# EAGLE design Robot Kicker v3.6 (EAGLE 4.16)
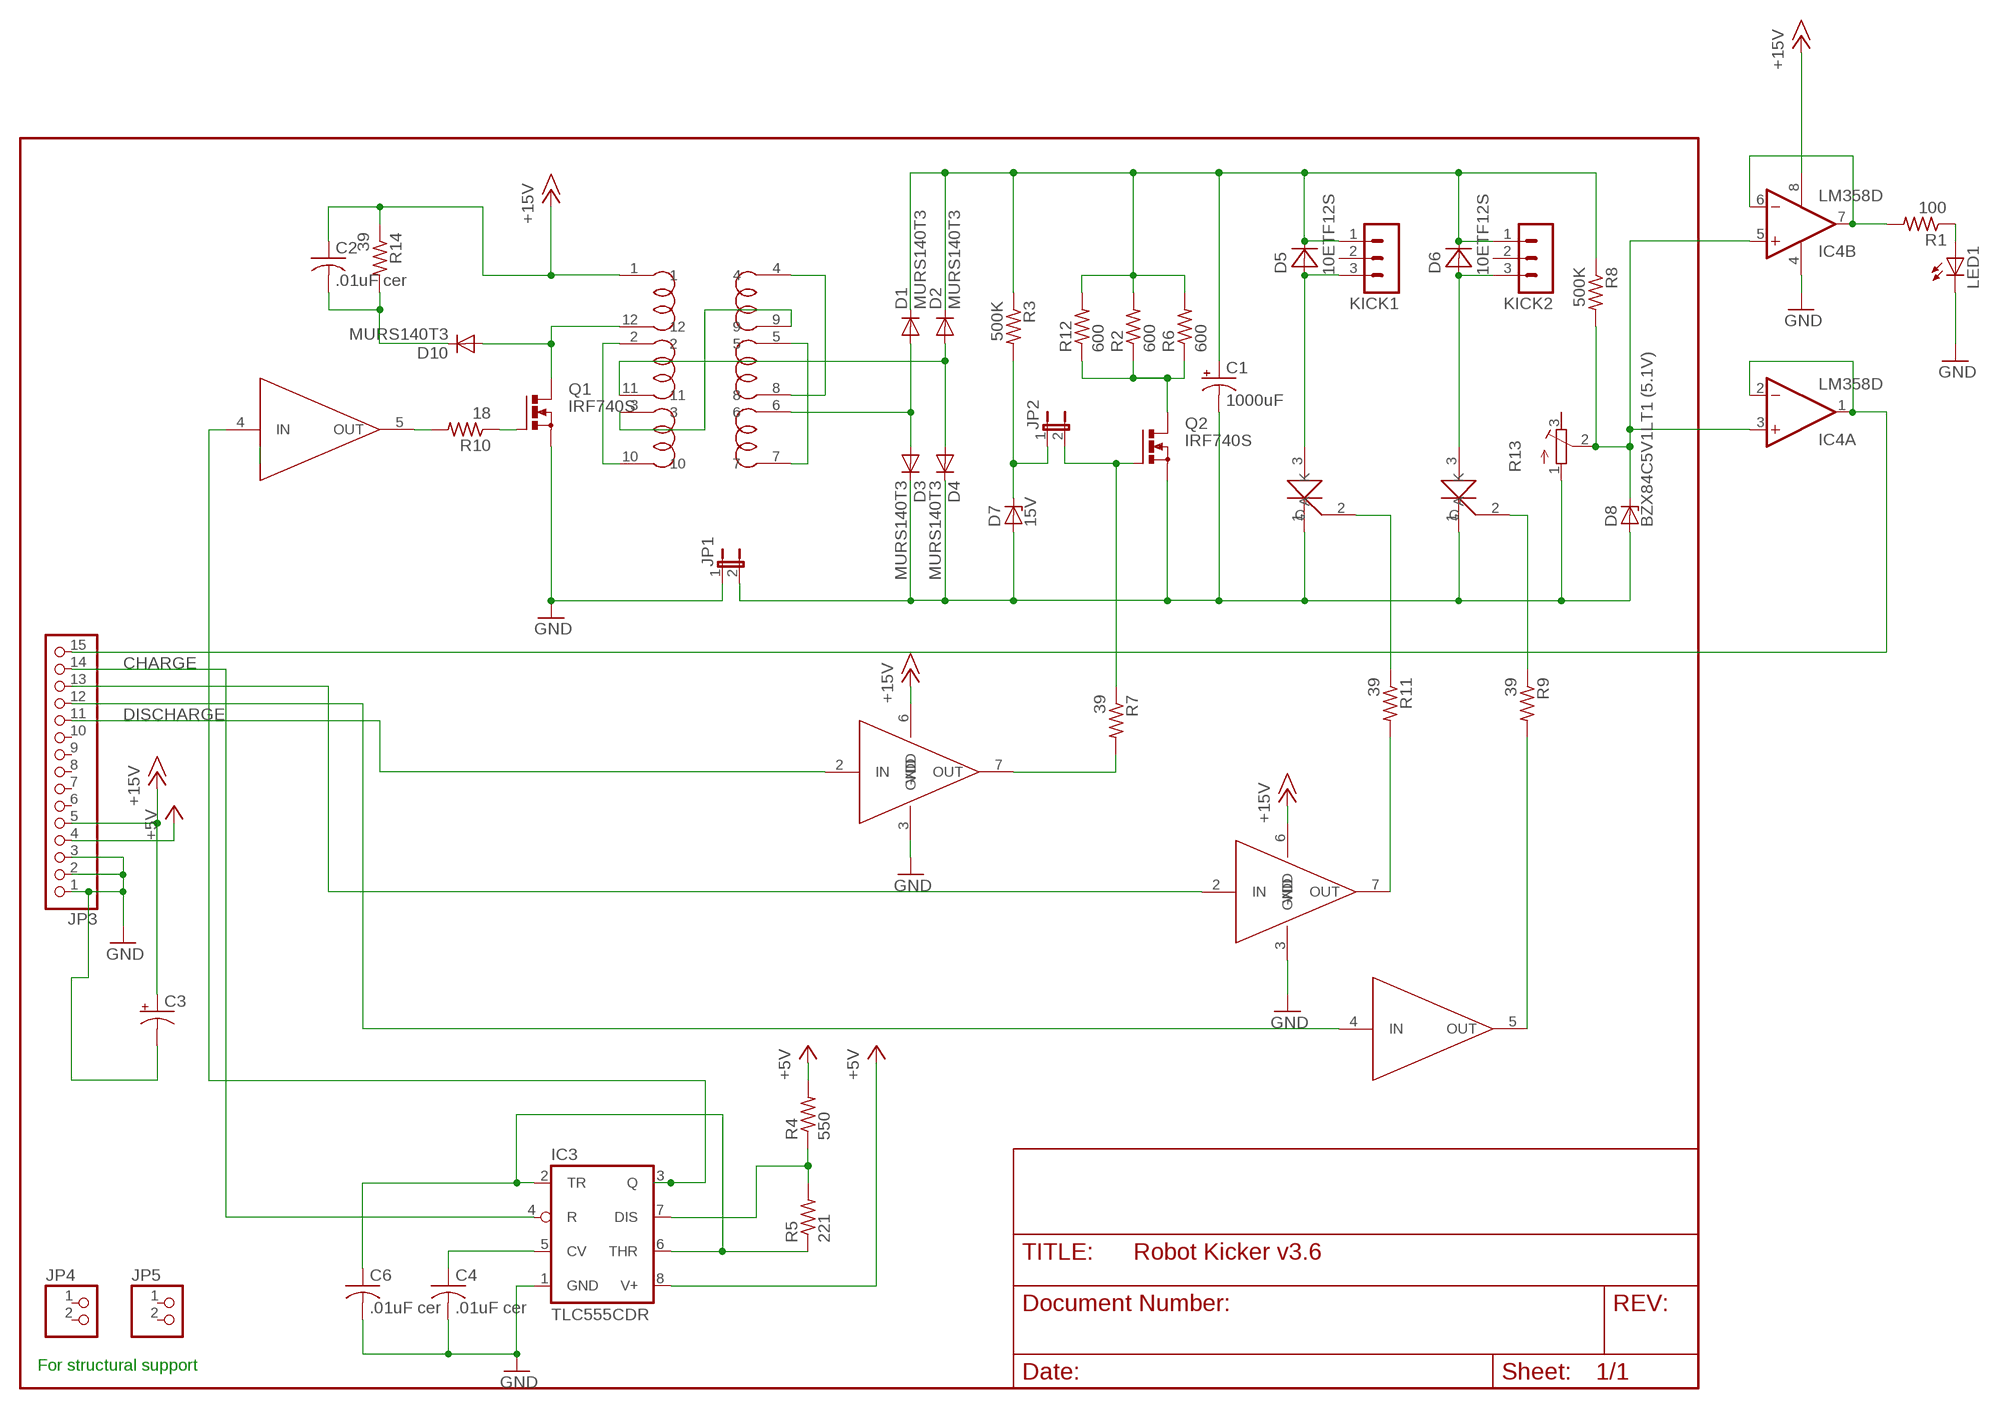
[diagram p0: schematic, sheet 1]

## Parts
C1  1000uF  CPOL-USE10-35  [EB35D]
C2  .01uF cer  C-USC1206  [C1206]
C3  CPOL-USE5-8.5  [E5-8,5]
C4  .01uF cer  C-USC1206  [C1206]
C6  .01uF cer  C-USC1206  [C1206]
D1  MURS140T3  ES2D  [SMB]
D2  MURS140T3  ES2D  [SMB]
D3  MURS140T3  ES2D  [SMB]
D4  MURS140T3  ES2D  [SMB]
D5  10ETF12S  [D2PACK]
D6  10ETF12S  [D2PACK]
D7  15V  ZENER-DIODESOT23  [SOT23]
D8  BZX84C5V1LT1 (5.1V)  ZENER-DIODESOT23  [SOT23]
D10  MURS140T3  ES2D  [SMB]
IC1  TC4424  [DIL08]
IC2  TC4424  [DIL08]
IC3  TLC555CDR  LM555D  [SO08]
IC4  LM358D  [SO08]
JP1  JP1E  [JP1]
JP2  JP1E  [JP1]
JP3  PINHD-1X15  [1X15]
JP4  PINHD-1X2  [1X02]
JP5  PINHD-1X2  [1X02]
KICK1  MA03-1  [MA03-1]
KICK2  MA03-1  [MA03-1]
LED1  LEDCHIPLED_1206  [CHIPLED_1206]
Q1  IRF740S  [D2PACK]
Q2  IRF740S  [D2PACK]
R1  100  R-US_R1206  [R1206]
R2  600  R-US_R2512  [R2512]
R3  500K  R-US_R1206  [R1206]
R4  550  R-US_R1206  [R1206]
R5  221  R-US_R1206  [R1206]
R6  600  R-US_R2512  [R2512]
R7  39  R-US_R1206  [R1206]
R8  500K  R-US_R1206  [R1206]
R9  39  R-US_R1206  [R1206]
R10  18  R-US_R1206  [R1206]
R11  39  R-US_R1206  [R1206]
R12  600  R-US_R2512  [R2512]
R13  R-TRIMM4G/J  [RTRIM4G/J]
R14  39  R-US_R1206  [R1206]
SCR3  SCR  [SCR]
SCR4  SCR  [SCR]
U$1  PCA20EFD  [PCA20EFD]

## Nets
+5V: IC3.8(V+) JP3.4 R4.2
+15V: C2.1 C3.+ IC1.6(VDD) IC2.6(VDD) IC4.8(P:V+) JP3.5 R14.1 U$1.1
ADC: IC4.1(A:OUT) IC4.2(A:-IN) JP3.15
CHARGE: IC3.4(R) JP3.14
DISCHARGE: IC1.2(IN) JP3.11
GND: C3.- C4.2 C6.2 IC1.3(GND) IC2.3(GND) IC3.1(GND) IC4.4(P:V-) JP1.1 JP3.1 JP3.2 JP3.3 LED1.C Q1.3(S)
HV+: C1.+ D1.C D2.C D5.2(C) D6.2(C) KICK1.1 KICK2.1 R2.2 R3.1 R6.2 R8.1 R12.2
HV-: C1.- D3.C D4.C D7.1(A) D8.1(A) JP1.2 Q2.3(S) R13.1(E) SCR3.1(K) SCR4.1(K)
KICK1: IC2.2(IN) JP3.13
KICK2: IC2.4(IN) JP3.12
N$1: U$1.3 U$1.9
N$2: IC1.4(IN) IC3.3(Q)
N$3: D10.A Q1.2(D) U$1.12
N$4: U$1.2 U$1.10
N$5: IC1.5(OUT) R10.2
N$6: JP2.2 Q2.1(G) R7.1
N$7: IC4.6(B:-IN) IC4.7(B:OUT) R1.2
N$8: U$1.5 U$1.7
N$9: U$1.4 U$1.8
N$10: D1.A D3.A U$1.6
N$11: D2.A D4.A U$1.11
N$12: Q2.2(D) R2.1 R6.1 R12.1
N$13: LED1.A R1.1
N$14: C6.1 IC3.2(TR) IC3.6(THR) R5.1
N$15: Q1.1(G) R10.1
N$16: C4.1 IC3.5(CV)
N$17: IC3.7(DIS) R4.1 R5.2
N$18: R11.1 SCR3.2(G)
N$19: IC1.7(OUT) R7.2
N$20: R9.1 SCR4.2(G)
N$21: D5.1(A) KICK1.3 SCR3.3(A)
N$23: IC2.7(OUT) R11.2
N$24: D6.1(A) KICK2.3 SCR4.3(A)
N$25: C2.2 D10.C R14.2
N$26: IC2.5(OUT) R9.2
N$30: D7.3(C) JP2.1 R3.2
V_DIV: D8.3(C) IC4.3(A:+IN) IC4.5(B:+IN) R8.2 R13.2(S)
Unconnected: JP3.6 JP3.7 JP3.8 JP3.9 JP3.10 JP4.1 JP4.2 JP5.1 JP5.2 KICK1.2 KICK2.2 R13.3(A)

## Notes on the sheet
- For structural support

## Library data of the parts
C1 C3 = rcl:CPOL-US: POLARIZED CAPACITOR, American symbol
C2 C4 C6 = rcl:C-US: CAPACITOR, American symbol
D1-D4 D10 = diode:ES2D: DIODE super fast rectifier, 2 A
D5 D6 = diode:10ETF12S
D7 D8 = diode:ZENER-DIODE: Z-Diode
IC1 IC2 = transistor-power:TC4424
IC3 = linear:*555: TIMER
IC4 = linear:LM358: OP AMP
JP1 JP2 = jumper:JP1E: JUMPER
JP3 = pinhead:PINHD-1X15: PIN HEADER
JP4 JP5 = pinhead:PINHD-1X2: PIN HEADER
KICK1 KICK2 = con-lstb:MA03-1: PIN HEADER
LED1 = led:LED: LED OSRAM: - CHIPLED LG R971, LG N971, LY N971, LG Q971, LY Q971, LO R971, LY R971 LH N974, LH R974 LS Q976, LO Q976, LY Q976 LO Q996 - Hyper CHIPLED LW Q18S LB Q993, LB Q99A, LB R99A - SideLED LS A670, LO A670, LY A670, LG A670, LP A670 LB A673, LV A673, LT A673, LW A673 LH A674 LY A675 LS A676, LA A676, LO A676, LY A676, LW A676 LS A679, LY A679, LG A679 - Hyper Micro SIDELED® LS Y876, LA Y876, LO Y876, LY Y876 LT Y87S - SmartLED LW L88C, LW L88S LB L89C, LB L89S, LG L890 LS L89K, LO L89K, LY L89K LS L896, LA L896, LO L896, LY L896 - TOPLED LS T670, LO T670, LY T670, LG T670, LP T670 LSG T670, LSP T670, LSY T670, LOP T670, LYG T670 LG T671, LOG T671, LSG T671 LB T673, LV T673, LT T673, LW T673 LH T674 LS T676, LA T676, LO T676, LY T676, LB T676, LH T676, LSB T676, LW T676 LB T67C, LV T67C, LT T67C, LS T67K, LO T67K, LY T67K, LW E67C LS E67B, LA E67B, LO E67B, LY E67B, LB E67C, LV E67C, LT E67C LW T67C LS T679, LY T679, LG T679 LS T770, LO T770, LY T770, LG T770, LP T770 LB T773, LV T773, LT T773, LW T773 LH T774 LS E675, LA E675, LY E675, LS T675 LS T776, LA T776, LO T776, LY T776, LB T776 LHGB T686 LT T68C, LB T68C - Hyper Mini TOPLED® LB M676 - Mini TOPLED Santana® LG M470 LS M47K, LO M47K, LY M47K Source: http://www.osram.convergy.de/
Q1 Q2 = transistor-power:IRF740S
R1-R12 R14 = rcl:R-US_: RESISTOR, American symbol
R13 = rcl:R-TRIMM: Trimm resistor
SCR3 SCR4 = SCR:SCR
U$1 = transformer:PCA20EFD

## Net classes
1 big: width 1.27 mm

## Board
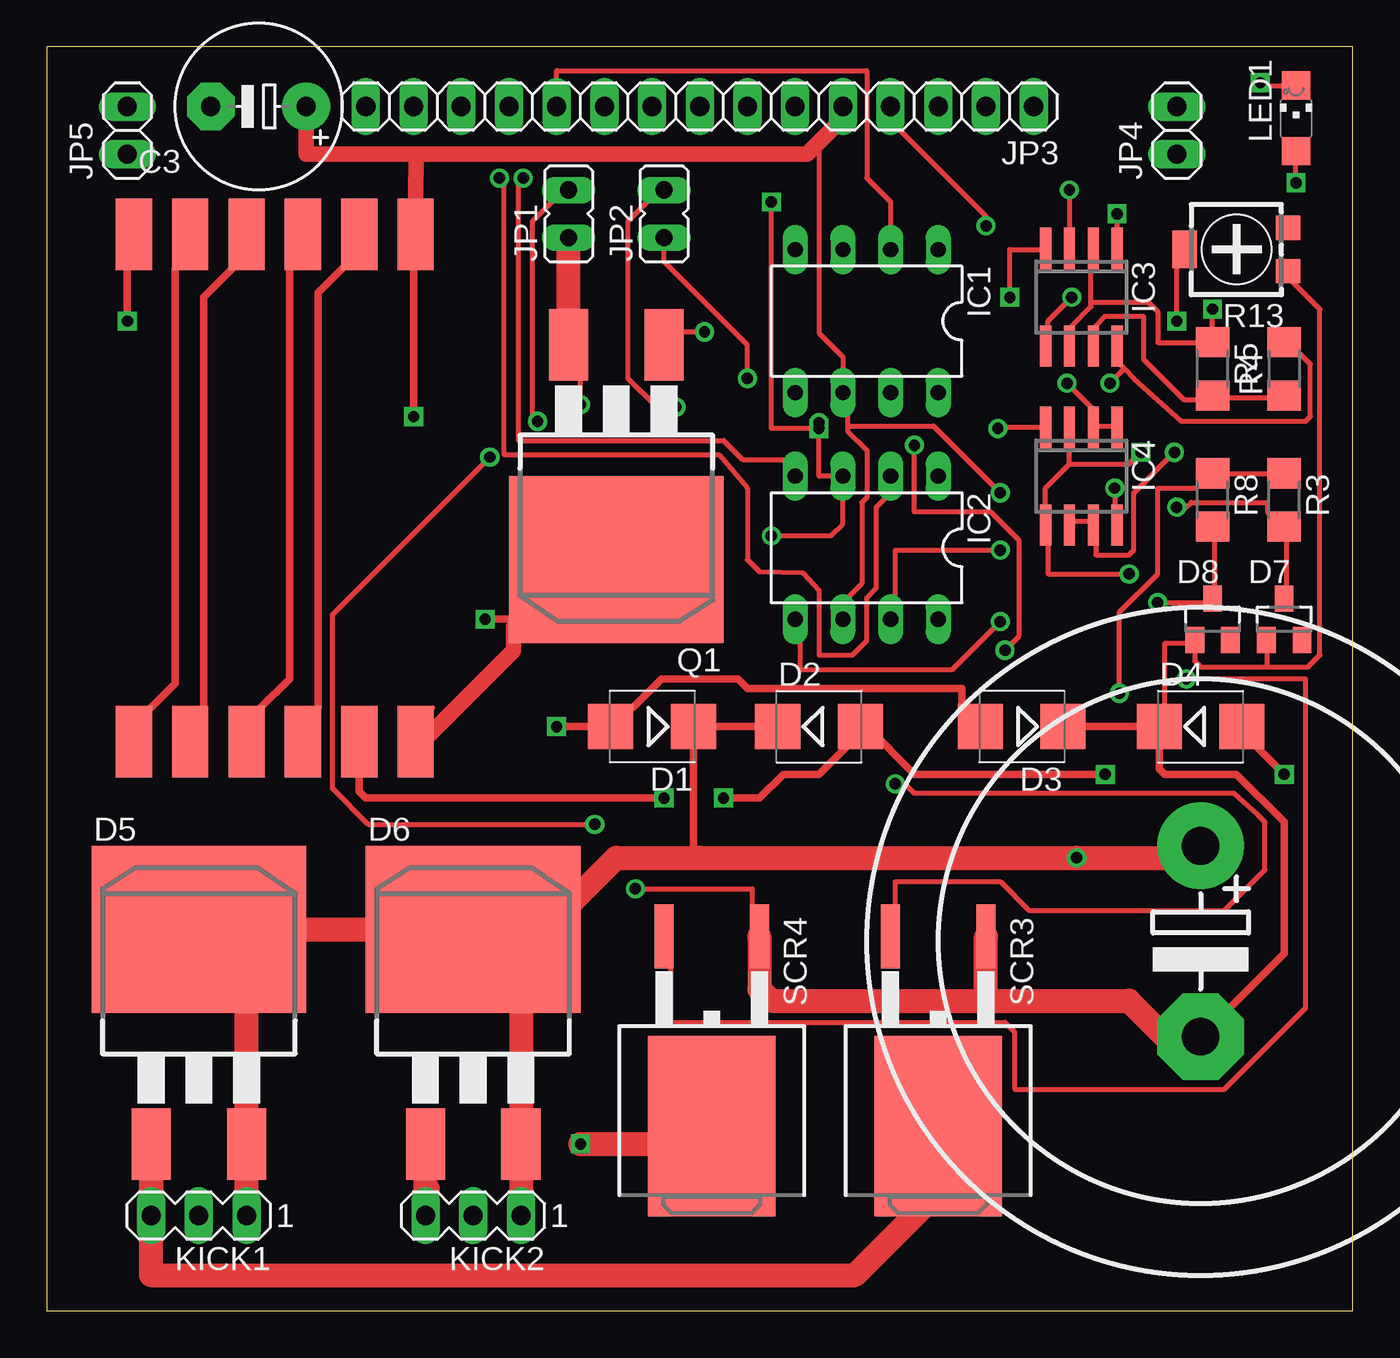
[diagram p1: board, top side]
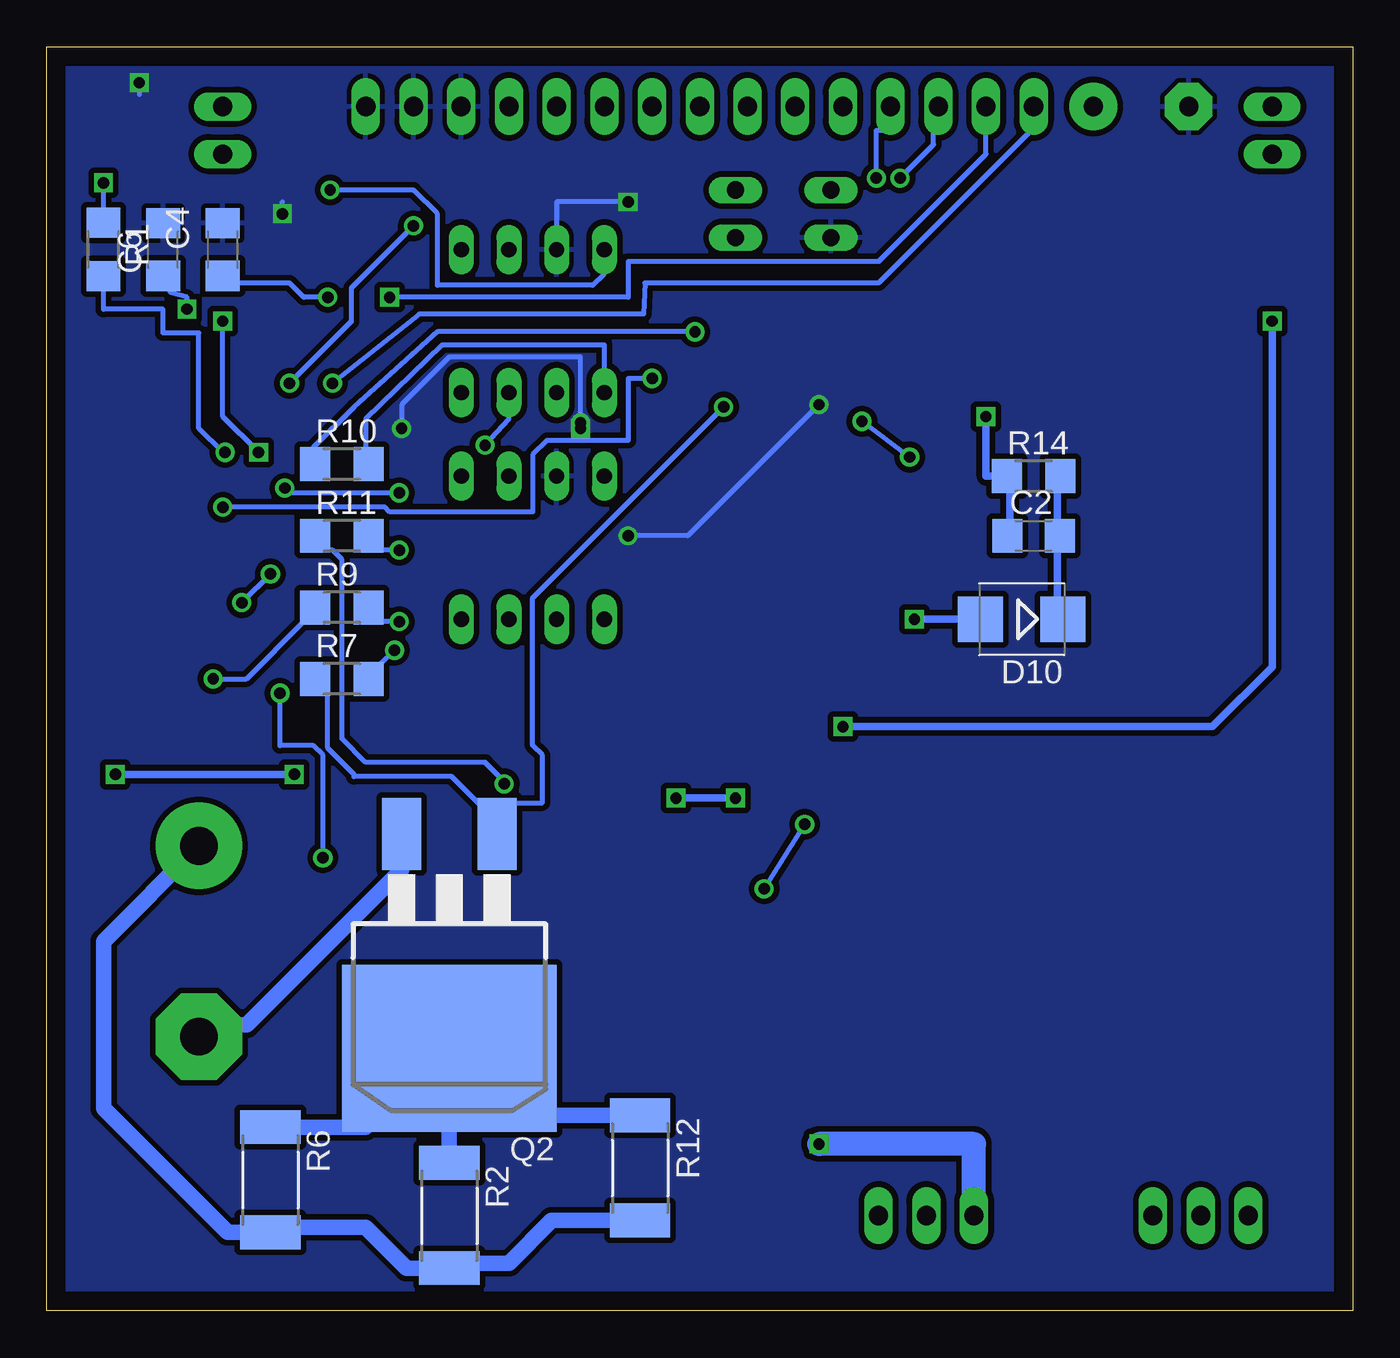
[diagram p2: board, bottom side, seen from below]

Size 69.52 x 67.3 mm. Coordinates in mm from the lower left corner, seen from the top.
Outline: 0,0 69.52,0 69.52,67.3 0,67.3 0,0
Copper layers (1*16): Top 0.035mm / dielectric 1.5mm / Bottom 0.035mm
Design rules "default": minimum track width 10mil, minimum drill 24mil, track to track 12mil, track to pad 12mil, pad to pad 8mil, via to via 8mil, smd to smd 8mil, copper to edge 40mil, drill to drill 8mil, minimum pad ring 10mil, minimum via ring 8mil, stop-mask expansion 4mil, vias tented up to drill 0mil, thermal gap 10mil

### Footprints (pad centres in the part's own frame; a part is rotated, then mirrored left to right if it is on the bottom)
EB35D = drill 2.007 pad 4.597 round: + -5.08,0 | drill 2.007 pad 4.597 octagon: - 5.08,0
C1206 = smd 1.6 x 1.8: 1 -1.4,0; 2 1.4,0
E5-8,5 = drill 1.016 pad 2.54 round: + -2.54,0 | drill 1.016 pad 2.54 octagon: - 2.54,0
SMB = smd 2.4 x 2.4: A 2.2,0; C -2.2,0
D2PACK = smd 2.083 x 3.81: 1 0,-10.16; 3 5.08,-10.16 | smd 11.43 x 8.89: 2 2.54,1.27
SOT23 = smd 1 x 1.4: 1 -0.95,-1.1; 2 0.95,-1.1; 3 0,1.1
DIL08 = drill 0.813 long: 1 -3.81,-3.81; 2 -1.27,-3.81; 3 1.27,-3.81; 4 3.81,-3.81; 5 3.81,3.81; 6 1.27,3.81; 7 -1.27,3.81; 8 -3.81,3.81
SO08 = smd 0.6 x 2.2: 1 -1.905,-2.6; 2 -0.635,-2.6; 3 0.635,-2.6; 4 1.905,-2.6; 5 1.905,2.6; 6 0.635,2.6; 7 -0.635,2.6; 8 -1.905,2.6
JP1 = drill 0.914 long: 1 0,-1.27; 2 0,1.27
1X15 = drill 1.016 long: 1 -17.78,0; 2 -15.24,0; 3 -12.7,0; 4 -10.16,0; 5 -7.62,0; 6 -5.08,0; 7 -2.54,0; 8 0,0; 9 2.54,0; 10 5.08,0; 11 7.62,0; 12 10.16,0; 13 12.7,0; 14 15.24,0; 15 17.78,0
1X02 = drill 1.016 long: 1 -1.27,0; 2 1.27,0
MA03-1 = drill 1.016 long: 1 -2.54,0; 2 0,0; 3 2.54,0
CHIPLED_1206 = smd 1.5 x 1.5: A 0,-1.75; C 0,1.75
D2PACK' = smd 2.083 x 3.81: 1 -2.54,-8.89; 3 2.54,-8.89 | smd 11.43 x 8.89: 2 0,2.54
R1206 = smd 1.6 x 1.803: 1 -1.422,0; 2 1.422,0
R2512 = smd 1.8 x 3.2: 1 -2.8,0; 2 2.8,0
RTRIM4G/J = smd 1.3 x 1.3: 1 -1.15,-2.75; 3 1.15,-2.75 | smd 2 x 1.3: 2 0,2.75
SCR = smd 1 x 3.4: 1 -2.54,-6.6; 2 2.54,-6.6 | smd 6.8 x 9.6: 3 0,3.5
PCA20EFD = smd 3.81 x 1.93: 1 -13.5,9; 2 -13.5,6; 3 -13.5,3; 4 -13.5,0; 5 -13.5,-3; 6 -13.5,-6; 7 13.5,-6; 8 13.5,-3; 9 13.5,0; 10 13.5,3; 11 13.5,6; 12 13.5,9

### Placement (x,y rotation side)
C1  61.43,19.68 270 top
C2  16.98,41.27 0 bottom
C3  11.27,64.13 180 top
C4  60.16,56.51 90 bottom
C6  63.34,56.51 90 bottom
D1  32.22,31.11 180 top
D2  41.11,31.11 0 top
D3  51.91,31.11 180 top
D4  61.43,31.11 0 top
D5  5.55,19.04 0 top
D6  20.15,19.04 0 top
D7  65.88,36.83 0 top
D8  62.06,36.83 0 top
D10  17.61,36.83 180 bottom
IC1  43.65,52.7 180 top
IC2  43.65,40.64 180 top
IC3  55.08,53.97 180 top
IC4  55.08,44.45 180 top
JP1  27.77,58.41 0 top
JP2  32.85,58.41 0 top
JP3  34.76,64.13 180 top
JP4  60.16,62.86 90 top
JP5  4.28,62.86 90 top
KICK1  8.09,5.08 180 top
KICK2  22.7,5.08 180 top
LED1  66.51,63.5 0 top
Q1  IRF740S  [D2PACK']  30.31,42.54 180 top
Q2  IRF740S  [D2PACK']  48.09,16.5 180 bottom
R1  66.51,56.51 270 bottom
R2  48.09,5.08 270 bottom
R3  65.88,43.18 270 top
R4  65.88,50.16 90 top
R5  62.06,50.16 270 top
R6  57.62,6.98 270 bottom
R7  53.81,33.65 0 bottom
R8  62.06,43.18 270 top
R9  53.81,37.46 0 bottom
R10  53.81,45.08 0 bottom
R11  53.81,41.27 0 bottom
R12  37.94,7.62 270 bottom
R13  63.34,56.51 90 top
R14  16.98,44.45 0 bottom
SCR3  47.46,13.33 180 top
SCR4  35.39,13.33 180 top
U$1  10.63,43.81 270 top

### Tracks (layer width: path | path; a pad name or v marks a point on that pad's centre or on a via)
+5V  (via drill 0.61)
  Top 0.254: 57.37,50.16 57.11,50.41 IC3.8 | 57.37,50.16 57.87,49.65 60.41,47.37 67.02,47.37 67.27,47.62 67.27,50.41 66.76,50.92 R4.2 | v50,57.78 50,58.29 45.43,62.86 JP3.4 | v56.6,49.4 57.37,50.16
  Bottom 0.254: v50,57.78 53.3,54.48 53.3,52.7 v56.6,49.4
+15V  (via drill 0.6, 0.61)
  Top 0.254: 42.63,47.11 42.63,47.62 IC1.6 42.38,50.8 41.11,52.07 41.11,62.23 | 42.63,47.11 42.63,46.86 43.65,45.84 43.65,43.3 43.4,43.05 43.4,38.73 42.63,37.97 IC2.6 | 40.92,62.03 41.11,61.84 | 42.38,63.5 JP3.5 | v56.86,43.81 56.86,42.79 IC4.8 | v50.76,43.56 47.21,47.11 42.63,47.11
  Top 0.406: U$1.1 19.52,57.31 v19.52,47.62
  Top 0.813: U$1.1 19.63,59.16 19.65,61.59 | 19.65,61.59 40.48,61.59 40.92,62.03 41.11,62.23 42.38,63.5 | C3.+ 13.81,61.59 19.65,61.59
  Bottom 0.254: v56.86,43.81 56.86,43.56 v50.76,43.56
  Bottom 0.406: C2.1 18.25,41.27 18.25,44.45 R14.1 19.52,44.45 v19.52,47.62
ADC  (via drill 0.61)
  Top 0.254: IC4.1 56.86,47.11 55.84,47.11 IC4.2 55.59,48.13 v54.32,49.4
  Bottom 0.254: v54.32,49.4 49.68,53.08 37.74,53.08 37.68,54.73 25.23,54.73 16.85,63.11 JP3.15
CHARGE  (via drill 0.6)
  Top 0.254: v51.27,53.97 51.27,56.51 53.17,56.51 IC3.4
  Bottom 0.254: JP3.14 19.52,61.59 25.23,55.88 38.57,55.88 38.57,53.97 v51.27,53.97
DISCHARGE
  Top 0.254: JP3.11 27.14,66.03 43.65,66.03 43.65,60.32 44.92,59.05 IC1.2
GND  (via drill 0.6)
  Top 0.254: v38.57,41.27 41.74,41.27 42.38,41.91 IC2.3 41.11,44.45 v41.11,46.98 | v28.41,48.26 28.41,50.8 Q1.3 | IC4.4 50.7,47.05 v50.63,46.98 | v41.11,46.98 v41.11,47.3 | 56.98,56.51 IC3.1 v56.98,58.41 | v41.11,46.98 38.57,46.98 v38.57,59.05 | LED1.C 64.61,65.24 v64.61,65.4
  Top 1.27: Q1.3 JP1.1
  Bottom 0.254: C4.2 60.16,57.78 | v38.57,41.27 35.39,41.27 v28.41,48.26 | v50.63,46.98 50.63,48.26 48.09,50.8 41.11,50.8 | v41.11,47.3 41.11,50.8 | v41.11,46.98 41.11,50.8 | v38.57,59.05 42.38,59.05 IC1.3 | v56.98,58.41 56.98,59.05 | v64.61,65.4 64.61,64.77
  pour Bottom: -5.88,-3.82 73.5,-3.82 73.5,69.84 -5.88,69.84
HV+  (via drill 0.61)
  Top 0.254: 8.73,20.31 D5.2 | R3.1 64.99,44.57 62.95,44.57 R8.1 61.18,43.81 59.14,43.81 59.14,39.24 57.11,37.21 v57.11,32.89
  Top 0.406: D2.C D1.C 34.42,24.46 34.76,24.12
  Top 1.27: KICK2.1 25.23,17.77 D6.2 | KICK1.1 10.63,19.68 9.36,19.68 8.73,20.31 D6.2 | D6.2 26.5,20.31 30.31,24.12 34.76,24.12 v54.83,24.12 60.8,24.12 C1.+
  Bottom 0.254: v57.11,32.89 57.11,30.09 55.33,30.09 54.83,29.59 v54.83,24.12
  Bottom 0.813: R12.2 42.64,4.81 44.92,2.54 48.09,2.54 R2.2 50.38,2.27 52.54,4.44 57.62,4.44 R6.2 59.9,4.18 66.51,10.79 66.51,19.68 C1.+
HV-  (via drill 0.61)
  Top 0.254: 59.52,31.11 59.52,35.55 60.8,35.55 60.96,35.73 D8.1 61.12,34.6 61.43,34.29 64.99,34.29 | v26.12,47.37 25.87,47.62 25.87,58.03 26.89,59.05 JP1.2 | v23.58,45.46 15.2,37.08 15.2,27.81 17.11,25.9 v29.17,25.9 | v31.33,22.47 37.55,22.47 37.55,21.46 SCR4.1 | R13.1 66,55.36 65.88,55.24 67.78,53.34 67.78,34.92 67.14,34.29 64.99,34.29 | D7.1 64.99,35.66 64.99,34.29
  Top 0.406: D4.C 59.52,31.11 | D4.C D3.C | D4.C 59.23,28.86 59.52,28.57 63.34,28.57 65.88,26.03 65.88,19.04 C1.-
  Top 1.27: C1.- 59.52,14.6 57.62,16.5 50,16.5 | 50,16.5 SCR3.1 | 50,16.5 38.57,16.5 37.94,17.14 SCR4.1
  Bottom 0.254: v23.58,45.46 v26.12,47.37 | v29.17,25.9 v31.33,22.47
  Bottom 0.813: Q2.3 50.63,23.49 58.89,15.24 60.8,15.24 C1.-
KICK1  (via drill 0.61)
  Top 0.254: v24.09,60.32 24.35,60.07 24.35,45.59 35.78,45.59 37.3,43.81 37.3,40 37.94,39.37 40.22,39.3 41.11,38.35 41.11,34.92 42.89,34.92 43.65,35.68 43.65,37.97 44.16,38.48 44.16,42.79 44.67,43.3 IC2.2
  Bottom 0.254: v24.09,60.32 22.31,62.1 22.31,62.86 JP3.13
KICK2  (via drill 0.61)
  Top 0.254: v25.36,60.32 25.11,60.07 25.11,46.35 36.03,46.35 37.05,45.33 39.33,45.33 IC2.4
  Bottom 0.254: v25.36,60.32 25.36,62.86 24.85,62.86 JP3.12
N$1
  Top 0.254: U$1.9 11.39,32.13 | 12.92,55.49 U$1.3
  Top 0.406: 11.39,32.13 12.92,33.65 12.92,55.49
N$2  (via drill 0.6)
  Top 0.254: 54.45,56.51 IC3.3 v54.45,59.69
  Bottom 0.254: IC1.4 39.84,55.24 40.48,54.61 48.73,54.61 48.73,58.41 50,59.69 v54.45,59.69
N$3  (via drill 0.6)
  Top 0.254: U$1.12 20.54,32.13 | 24.85,36.44 25.74,37.02 Q1.2
  Top 0.406: 25.74,37.02 25.87,37.02 25.87,36.83 v23.33,36.83
  Top 0.813: 24.85,36.44 24.85,35.17 19.63,29.95
  Top 1.27: 19.52,29.84 19.63,29.95 U$1.12
  Bottom 0.406: v23.33,36.83 D10.A
N$4
  Top 0.254: U$1.10 14.44,32.13 | 15.71,55.49 U$1.2
  Top 0.406: 14.44,32.13 14.44,54.22 15.71,55.49
N$5
  Bottom 0.254: IC1.5 39.84,51.43 48.48,51.43 52.54,47.49 52.54,45.08 R10.2
N$6  (via drill 0.61)
  Top 0.254: v33.49,48.13 32.47,48.13 30.95,49.65 30.95,58.03 31.97,59.05 JP2.2
  Bottom 0.254: 46.23,26.64 Q2.1 44.67,27.05 43.14,27.05 43.14,29.59 43.65,30.09 43.65,37.97 v33.49,48.13 | 46.23,26.64 46.44,27.05 | 46.23,26.64 46.21,26.64 46.19,26.66 47.97,28.44 53.17,28.44 53.17,28.57 54.57,29.97 54.57,32.89 R7.1
N$7  (via drill 0.61)
  Top 0.254: v60.03,45.72 57.87,43.56 57.87,40.51 57.62,40.25 55.84,40.25 55.84,40.76 IC4.7 55.59,42.03 54.57,42.03 IC4.6
  Bottom 0.254: R1.2 65.75,54.48 | v60.03,45.72 60.16,45.72 61.43,46.98 61.43,52.07 63.34,52.07 63.34,53.34 66.51,53.34 R1.2 | R1.2 66.51,55.24
N$8
  Top 0.254: U$1.7 5.55,32.13 | 6.82,55.49 U$1.5
  Top 0.406: 5.55,32.13 6.82,33.4 6.82,55.49
N$9
  Top 0.254: U$1.8 8.34,32.13 | 9.87,55.49 U$1.4
  Top 0.406: 8.34,32.13 8.34,53.97 9.87,55.49
N$10  (via drill 0.6)
  Top 0.254: D1.A 31.2,32.13 | 48.73,32.13 D3.A
  Top 0.406: 31.2,32.13 32.73,33.65 36.79,33.65 37.3,33.14 48.73,33.14 48.73,32.13 | v27.14,31.11 D1.A | U$1.6 4.75,57.31 4.92,57.15 4.28,56.51 v4.28,52.7
  Bottom 0.406: v27.14,31.11 7.46,31.11 4.28,34.29 v4.28,52.7
N$11  (via drill 0.6)
  Top 0.406: U$1.11 16.63,27.65 16.98,27.3 v32.85,27.3 | v36.03,27.3 37.94,27.3 39.2,28.57 41.11,28.57 43.02,30.47 43.02,31.11 D2.A 43.65,31.11 46.19,28.57 v56.35,28.57 | D4.A 63.34,31.11 v65.88,28.57
  Bottom 0.406: v32.85,27.3 v36.03,27.3 | v56.35,28.57 v65.88,28.57
N$12
  Bottom 0.254: Q2.2 52.54,9.77
  Bottom 0.813: R12.1 43.91,10.42 48.09,14.6 Q2.2 R2.1 48.09,7.62 | R6.1 57.62,9.52 57.37,9.77 52.54,9.77
N$13  (via drill 0.6)
  Top 0.254: v66.51,60.07 LED1.A
  Bottom 0.254: R1.1 v66.51,60.07
N$14  (via drill 0.6)
  Top 0.254: 55.59,53.72 55.59,55.49 IC3.2 | 55.59,53.72 55.59,53.46 54.57,52.45 IC3.6 | 55.59,53.72 58.64,53.72 59.14,53.21 59.14,51.56 61.18,51.56 61.43,51.56 | 61.43,51.56 R5.1 | 61.43,51.56 61.43,51.43 62.06,52.07 v62.06,53.34
  Bottom 0.254: C6.1 62.95,54.48 62.95,54.22 62.06,53.97 v62.06,53.34
N$15  (via drill 0.61)
  Top 0.254: v35.01,52.13 32.79,52.13 Q1.1
  Bottom 0.254: v35.01,52.13 48.73,52.13 53.17,48.13 55.33,45.97 55.08,45.33 54.57,45.84 R10.1
N$16  (via drill 0.61)
  Top 0.254: v54.57,53.97 53.3,52.7 53.3,52.45 IC3.5
  Bottom 0.254: v54.57,53.97 55.84,53.97 56.6,54.73 60.16,54.73 | 59.4,54.73 C4.1 60.16,54.73 | 60.16,54.73 60.16,54.61
N$17
  Top 0.254: R4.1 64.99,48.64 62.95,48.64 R5.2 62.45,48.51 60.54,48.51 58.38,50.67 58.38,52.95 56.35,52.95 55.84,52.45 IC3.7
N$18  (via drill 0.61)
  Top 0.254: v45.17,28.06 45.68,28.06 46.19,27.55 63.21,27.55 64.48,26.41 64.86,26.03 64.86,23.49 62.7,21.33 52.29,21.33 50.76,22.86 45.17,22.86 45.17,21.46 SCR3.2
  Bottom 0.254: R11.1 54.57,40.51 54.32,40.51 53.81,40 53.81,30.47 52.54,29.2 46.19,29.2 45.05,28.06 | 45.05,28.06 44.92,27.93 | v45.17,28.06 45.05,28.06
N$19  (via drill 0.61)
  Top 0.254: v51.02,35.17 51.78,35.94 51.78,41.02 50.25,42.54 46.19,42.54 v46.19,46.1
  Bottom 0.254: v51.02,35.17 51.78,34.41 R7.2 | v46.19,46.1 44.92,47.49 IC1.7
N$20  (via drill 0.61)
  Top 0.254: v60.67,33.65 67.02,33.65 67.02,16.12 62.7,11.81 51.52,11.81 51.52,14.85 51.02,15.36 33.24,15.36 33.24,18.41 SCR4.2
  Bottom 0.254: v60.67,33.65 58.89,33.65 55.84,36.7 R9.1
N$21
  Top 1.27: KICK1.3 D5.1 5.55,1.9 43.02,1.9 47.46,6.34 SCR3.3
N$23  (via drill 0.61)
  Top 0.254: v50.76,40.51 45.17,40.51 45.17,37.97 IC2.7
  Bottom 0.254: v50.76,40.51 51.78,40.51 R11.2
N$24  (via drill 0.6)
  Top 1.27: KICK2.3 20.15,4.44 | KICK2.3 20.15,6.47 | 20.15,6.47 D6.1 | SCR4.3 35.39,9.52 34.76,8.89 v28.41,8.89 | 20.15,6.47 20.28,6.47 KICK2.3
  Bottom 1.27: KICK2.3 D6.1 v28.41,8.89
N$25
  Bottom 0.406: R14.2 15.71,44.45 15.71,41.27 | 15.71,41.27 C2.2 | 15.71,41.27 15.71,36.19 15.08,36.19 15.08,36.83 D10.C
N$26  (via drill 0.61)
  Top 0.254: v50.76,36.7 48.22,34.16 40.09,34.16 40.09,35.68 IC2.5
  Bottom 0.254: v50.76,36.7 51.78,36.7 R9.2
N$30  (via drill 0.61)
  Top 0.254: D7.3 66,38.48 66,41.02 R3.2 64.99,42.54 64.99,43.05 60.92,43.05 60.67,42.79 v60.16,42.79 | JP2.1 32.85,55.88 37.3,51.43 v37.3,49.65 37.3,49.53
  Bottom 0.254: v37.3,49.65 38.57,49.65 38.57,46.35 42.89,46.35 43.65,45.59 43.65,42.54 51.27,42.54 51.52,42.79 v60.16,42.79
V_DIV  (via drill 0.6, 0.61)
  Top 0.254: R8.2 62.19,41.02 62.19,38.48 D8.3 61.68,37.71 v59.14,37.71 | v57.62,39.24 53.3,39.24 53.3,40.76 IC4.5 53.17,43.81 54.45,45.08 | 54.45,45.08 IC4.3 | 54.45,45.08 57.62,45.08 v58.25,45.72 | R13.2 60.16,56.51 v60.16,52.7
  Bottom 0.254: v57.62,39.24 v59.14,37.71 | v58.25,45.72 60.16,47.62 v60.16,52.7